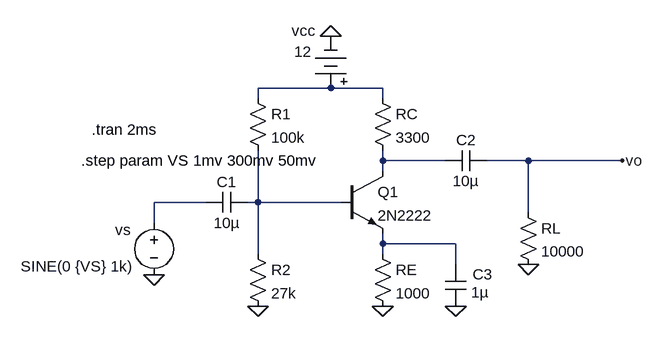
[diagram p0: schematic Draft13.asc]
Draft13.asc, the LTspice schematic file:
Version 4
SHEET 1 880 680
WIRE 176 0 64 0
WIRE 256 0 176 0
WIRE 64 16 64 0
WIRE 256 16 256 0
WIRE 256 112 256 96
WIRE 352 112 256 112
WIRE 480 112 416 112
WIRE 624 112 480 112
WIRE 256 128 256 112
WIRE -16 176 -96 176
WIRE 64 176 64 96
WIRE 64 176 48 176
WIRE 192 176 64 176
WIRE 480 192 480 112
WIRE -96 208 -96 176
WIRE 256 240 256 224
WIRE 368 240 256 240
WIRE 64 256 64 176
WIRE 256 256 256 240
WIRE 368 272 368 240
FLAG 624 112 vo
FLAG -96 288 0
FLAG 64 336 0
FLAG 256 336 0
FLAG 368 336 0
FLAG 480 272 0
FLAG 176 -80 0
SYMBOL voltage -96 192 R0
WINDOW 0 -60 27 Left 2
WINDOW 3 -205 83 Left 2
WINDOW 123 0 0 Left 0
WINDOW 39 0 0 Left 0
SYMATTR InstName vs
SYMATTR Value SINE(0 {VS} 1k)
SYMBOL cap 48 160 R90
WINDOW 0 0 32 VBottom 2
WINDOW 3 32 32 VTop 2
SYMATTR InstName C1
SYMATTR Value 10µ
SYMBOL res 48 0 R0
SYMATTR InstName R1
SYMATTR Value 100k
SYMBOL res 48 240 R0
SYMATTR InstName R2
SYMATTR Value 27k
SYMBOL res 240 0 R0
SYMATTR InstName RC
SYMATTR Value 3300
SYMBOL res 240 240 R0
SYMATTR InstName RE
SYMATTR Value 1000
SYMBOL res 464 176 R0
SYMATTR InstName RL
SYMATTR Value 10000
SYMBOL npn 192 128 R0
SYMATTR InstName Q1
SYMATTR Value 2N2222
SYMBOL cap 416 96 R90
WINDOW 0 0 32 VBottom 2
WINDOW 3 32 32 VTop 2
SYMATTR InstName C2
SYMATTR Value 10µ
SYMBOL cap 352 272 R0
WINDOW 0 42 15 Left 2
WINDOW 3 40 43 Left 2
SYMATTR InstName C3
SYMATTR Value 1µ
SYMBOL Misc\\battery 176 16 R180
WINDOW 0 24 104 Left 2
WINDOW 3 29 72 Left 2
WINDOW 123 0 0 Left 0
WINDOW 39 0 0 Left 0
SYMATTR InstName vcc
SYMATTR Value 12
TEXT -192 64 Left 2 !.tran 2ms
TEXT -208 112 Left 2 !.step param VS 1mv 300mv 50mv

The netlist it stands for:
* Draft13.asc
vs N003 0 SINE(0 {VS} 1k)
C1 N004 N003 10µ
R1 N001 N004 100k
R2 N004 0 27k
RC N001 N002 3300
RE N005 0 1000
RL vo 0 10000
Q1 N002 N004 N005 0 2N2222
C2 vo N002 10µ
C3 N005 0 1µ
vcc N001 0 12
.model NPN NPN
.model PNP PNP
.lib standard.bjt
.tran 2ms
.step param VS 1mv 300mv 50mv
.backanno
.end